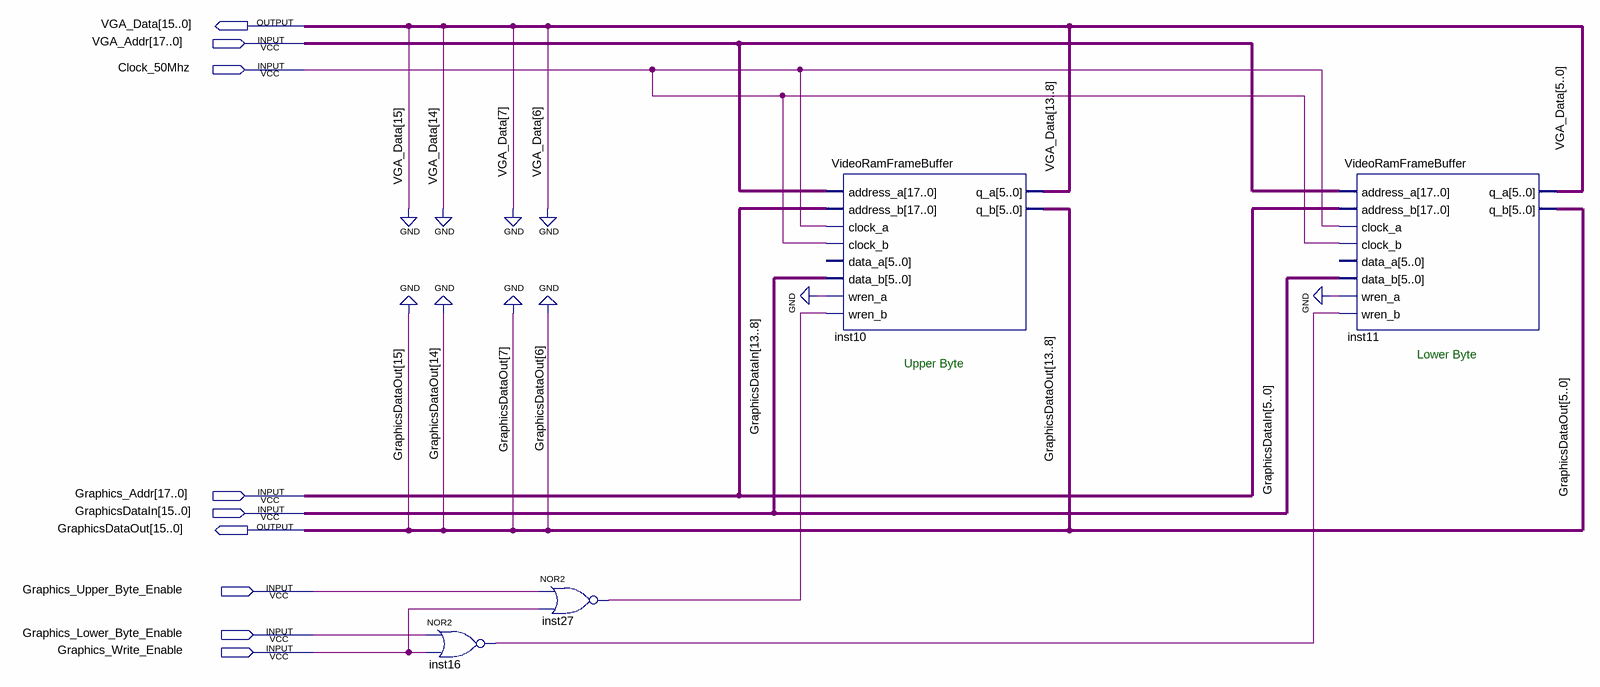
[diagram p0: schematic sheet]
// Quartus schematic GraphicsFrameBufferMemory.bdf as structural Verilog: 4 symbols, 9 pins
module GraphicsFrameBufferMemory (
  input  [17:0] VGA_Addr,
  input  Clock_50Mhz,
  input  [17:0] Graphics_Addr,
  input  [15:0] GraphicsDataIn,
  input  Graphics_Upper_Byte_Enable,
  input  Graphics_Lower_Byte_Enable,
  input  Graphics_Write_Enable,
  output [15:0] VGA_Data,
  output [15:0] GraphicsDataOut
);

  wire inst16_out, inst27_out;

  nor inst16 (inst16_out, Graphics_Lower_Byte_Enable, Graphics_Write_Enable);
  nor inst27 (inst27_out, Graphics_Upper_Byte_Enable, Graphics_Write_Enable);
  VideoRamFrameBuffer inst10 (
    .address_a(VGA_Addr), .address_b(Graphics_Addr), .clock_a(Clock_50Mhz), .clock_b(Clock_50Mhz),
    .data_b(GraphicsDataIn[13:8]), .wren_a(1'b0), .wren_b(inst27_out), .q_a(VGA_Data[13:8]),
    .q_b(GraphicsDataOut[13:8]));  // open: data_a
  VideoRamFrameBuffer inst11 (
    .address_a(VGA_Addr), .address_b(Graphics_Addr), .clock_a(Clock_50Mhz), .clock_b(Clock_50Mhz),
    .data_b(GraphicsDataIn[5:0]), .wren_a(1'b0), .wren_b(inst16_out), .q_a(VGA_Data[5:0]),
    .q_b(GraphicsDataOut[5:0]));  // open: data_a

  assign {GraphicsDataOut[15:14], GraphicsDataOut[7:6]} = 4'b0000;
  assign {VGA_Data[15:14], VGA_Data[7:6]} = 4'b0000;

  // Notes on the sheet:
  //   Lower Byte
  //   Upper Byte
endmodule
